# Altium schematic sheet MCU.SchDoc
size A; SheetNumber: 4; SheetTotal: 7
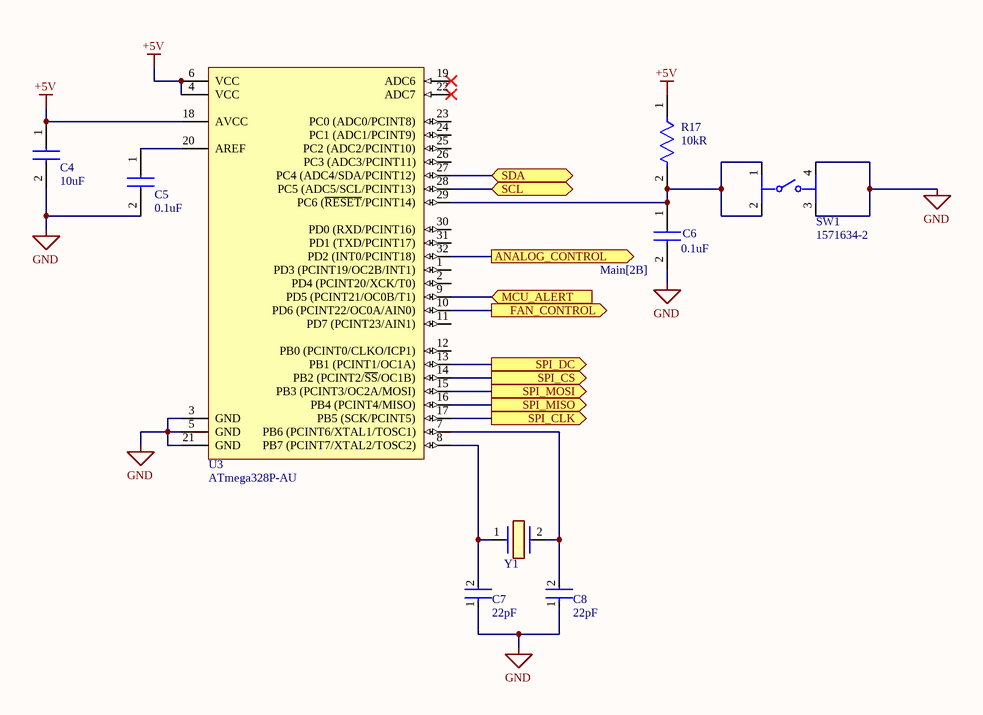
[diagram p0: MCU.SchDoc]

## Parts
C4  Capacitance: 10uF  [CAPC3216X180N]  (hidden comment: CL31A106MAHNNNE)
C5  Capacitance: 0.1uF  [CAPC3216X100N]  (hidden comment: CL31B104KBCNNNC)
C6  Capacitance: 0.1uF  [CAPC3216X100N]  (hidden comment: CL31B104KBCNNNC)
C7  Capacitance: 22pF  [FP-CL31-IPC_A]  (hidden comment: CL31C220JBCNNNC)
C8  Capacitance: 22pF  [FP-CL31-IPC_A]  (hidden comment: CL31C220JBCNNNC)
R17  Resistance: 10kR  [FP-RMCF1206-IPC_B]  (hidden comment: RMCF1206FT10K0)
SW1  1571634-2  [FP-1571634-2-MFG]
U3  ATmega328P-AU  [32A_M]
Y1  ECS-160-20-3X-TR  [ECS160203XTR]  (value not drawn)

## Ports
ANALOG_CONTROL (out, see Main[2B]), FAN_CONTROL (out, see Main[1B]), MCU_ALERT (in, see Main[2C], Sense Amplifier[4C]), SCL (bidir, see Main[2C], DAC[2B], Sense Amplifier[3B]), SDA (bidir, see Main[2C], DAC[2B], Sense Amplifier[3B]), SPI_CLK (out, see Main[1C]), SPI_CS (out, see Main[1C]), SPI_DC (out, see Main[1C]), SPI_MISO (out, see Main[1C]), SPI_MOSI (out, see Main[1C])

## Nets
+5V: C4.1 R17.1 U3.4(VCC) U3.6(VCC) U3.18(AVCC)
GND: C4.2 C5.2 C6.2 C7.1 C8.1 SW1.3 SW1.4 U3.3(GND) U3.5(GND) U3.21(GND)
ANALOG_CONTROL: U3.32(PD2_(INT0/PCINT18)) ; port ANALOG_CONTROL
FAN_CONTROL: U3.10(PD6_(PCINT22/OC0A/AIN0)) ; port FAN_CONTROL
MCU_ALERT: U3.9(PD5_(PCINT21/OC0B/T1)) ; port MCU_ALERT
SCL: U3.28(PC5_(ADC5/SCL/PCINT13)) ; port SCL
SDA: U3.27(PC4_(ADC4/SDA/PCINT12)) ; port SDA
SPI_CLK: U3.17(PB5_(SCK/PCINT5)) ; port SPI_CLK
SPI_CS: U3.14(PB2_(PCINT2/~{SS}/OC1B)) ; port SPI_CS
SPI_DC: U3.13(PB1_(PCINT1/OC1A)) ; port SPI_DC
SPI_MISO: U3.16(PB4_(PCINT4/MISO)) ; port SPI_MISO
SPI_MOSI: U3.15(PB3_(PCINT3/OC2A/MOSI)) ; port SPI_MOSI
NetC5_1: C5.1 U3.20(AREF)
NetC6_1: C6.1 R17.2 SW1.1 SW1.2 U3.29(PC6_(~{RESET}/PCINT14))
NetC7_2: C7.2 U3.8(PB7_(PCINT7/XTAL2/TOSC2)) Y1.1(X1)
NetC8_2: C8.2 U3.7(PB6_(PCINT6/XTAL1/TOSC1)) Y1.2(X2)

Not connected (* = marked no-connect by the designer): U3 1(PD3_(PCINT19/OC2B/INT1)) 2(PD4_(PCINT20/XCK/T0)) 11(PD7_(PCINT23/AIN1)) 12(PB0_(PCINT0/CLKO/ICP1)) 19(ADC6)* 22(ADC7)* 23(PC0_(ADC0/PCINT8)) 24(PC1_(ADC1/PCINT9)) 25(PC2_(ADC2/PCINT10)) 26(PC3_(ADC3/PCINT11)) 30(PD0_(RXD/PCINT16)) 31(PD1_(TXD/PCINT17))

## Library data of the parts
C4 = CL31A106MAHNNNE: CAP CER 10UF 25V X5R 1206 CL31A106MAHNNNE; Manufacturer_Name: SAMSUNG; Datasheet Link: https://www.arrow.com/en/products/cl31a106mahnnne/samsung-electro-mechanics; Height: 1.8mm; Manufacturer_Part_Number: CL31A106MAHNNNE; Mouser Part Number: 187-CL31A106MAHNNNE; Mouser Price/Stock: https://www.mouser.co.uk/ProductDetail/Samsung-Electro-Mechanics/CL31A106MAHNNNE?qs=9y2YoPkPyvYkOWbcUKSn%252BQ%3D%3D; Arrow Part Number: CL31A106MAHNNNE; Arrow Price/Stock: https://www.arrow.com/en/products/cl31a106mahnnne/samsung-electro-mechanics; Supplier 1: Digi-Key; Supplier Part Number 1: 1276-1181-1-ND
C5 C6 = CL31B104KBCNNNC: CAP CER 0.1UF 50V X7R 1206; Manufacturer_Name: SAMSUNG; Datasheet Link: https://datasheet.datasheetarchive.com/originals/distributors/Datasheets_SAMA/0fdb6a11e020a7299f4d0713dd2bd7ee.pdf; Height: 1mm; Mouser Part Number: 187-CL31B104KBCNNNC; Mouser Price/Stock: https://www.mouser.co.uk/ProductDetail/Samsung-Electro-Mechanics/CL31B104KBCNNNC?qs=349EhDEZ59oHABbyGq1iKA%3D%3D; Arrow Part Number: CL31B104KBCNNNC; Arrow Price/Stock: https://www.arrow.com/en/products/cl31b104kbcnnnc/samsung-electro-mechanics?region=nac; Supplier 1: Digi-Key; Supplier Part Number 1: 1276-1017-1-ND
  C5: Manufacturer_Part_Number 1: CL31B104KBCNNNC
  C6: Manufacturer_Part_Number: CL31B104KBCNNNC
C7 C8 = CMP-13271-001055-1: Cap Ceramic 22pF 50V C0G ±5% SMD 1206 +125°C Embossed T/R; Temperature Coefficient: 300ppm/°C; Packaging: Tape and Reel; Material: Ceramic; Package Quantity: 1; Thickness: 0.039inch; Voltage: 50V; Height: 0.85mm; Radiation Hardening: No; Mount: Surface Mount; Width: 0.063inch; Min Operating Temperature: -55°C; Max Operating Temperature: 125°C; Voltage Rating (DC): 50V; Voltage Rating: 50V; Case/Package: 1206; Case Code (Metric): 3216; Tolerance: 5%; Length: 3.2mm; Dielectric: C0G; Lead Free: Lead Free; Depth: 1.6mm; Case Code (Imperial): 1206
R17 = CMP-26527-000151-1: 10kΩ ±1% 0.25W 1206 Thick Film Chip Resistor AEC-Q200 compliant RMCF1206FT10K0; Temperature Coefficient: 100ppm/°C; Max Power Dissipation: 250mW; Packaging: Tape and Reel; Resistor Type: Thick Film; Number of Terminations: 2; Depth: 1.6mm; Military Standard: Not; Contact Plating: Tin; Radiation Hardening: No; Lead Free: Lead Free; Tolerance: 1%; Length: 3.2mm; Size Code: 1206; RoHS Compliant: Yes; Case/Package: 1206; Mount: Surface Mount; Features: Automotive AEC-Q200; Min Operating Temperature: -55°C; Series: RMCF; Case Code (Imperial): 1206; Construction: Rectangular; Max Operating Temperature: 155°C; Width: 0.063inch; Height: 0.028inch; Power Rating: 250mW; Case Code (Metric): 3216
SW1 = CMP-03407-000008-1: SWITCH TACTILE SPST-NO 0.05A 24V; Actuator Length: 0.094inch; Max Current Rating: 50mA; Voltage Rating (DC): 12V; Actuator Material: Rubber; Switch Function: Off-Mom; Mechanical Life: 5000000Cycles; Actuator Type: Standard; Actuator Color: Natural; Illumination Type: Illuminated; Operating Force: 160gf; Throw Configuration: SPST; Package Quantity: 1000; Max Operating Temperature: 85°C; Mount: Surface Mount; Contact Plating: Silver; Depth: 10mm; Min Operating Temperature: -40°C; Radiation Hardening: No; ELV: Compliant; Case/Package: SMD/SMT; Length: 6.2mm; Termination: Gull Wing; Type: Switch; RoHS Compliant: Yes; Current Rating: 50mA; Contact Current Rating: 50mA; Orientation: Straight; Packaging: Tape and Reel; Max Voltage Rating (DC): 12V; Lead Free: Lead Free; Contact Material: Stainless Steel
U3 = CMP-0095-00269-2: 8-bit AVR Microcontroller, 32KB Flash, 1KB EEPROM, 2KB SRAM, 32-pin TQFP, Industrial Grade (-40°C to 85°C); PackageDescription: 32-Lead, 7x7x1.0 mm Body, 0.8mm Lead Pitch, Thin Profile Plastic Quad Flat Package (TQFP); DatasheetVersion: revD, May-2011; RevisionNote: DatasheetVersion & PackageVersion updated. URLs added.; ComponentLink1URL: http://www.atmel.com/; ComponentLink2Description: ATmega48A/48PA/88A/88PA/168A/168PA/328/328P Datasheet; Code_JEDEC: MS-026-ABA; ComponentLink1Description: Manufacturer URL; PackageReference: 32A; ComponentLink3Description: ATmega48A/48PA/88A/88PA/168A/168PA/328/328P Summary; ComponentLink2URL: http://www.atmel.com/dyn/resources/prod_documents/doc8271.pdf; PackageVersion: revC, Oct-2010; ComponentLink3URL: http://www.atmel.com/dyn/resources/prod_documents/8271S.pdf
Y1 = ECS-160-20-3X-TR: Crystal or Oscillator; Manufacturer_Name: ECS; Datasheet Link: https://www.arrow.com/en/products/ecs-160-20-3x-tr/ecs-international; Height: 2.3mm; Manufacturer_Part_Number: ECS-160-20-3X-TR; Mouser Part Number: 520-160-20-3XT; Mouser Price/Stock: https://www.mouser.co.uk/ProductDetail/ECS/ECS-160-20-3X-TR?qs=7Z%2FjUg96RbU1ElbRFXn8Rw%3D%3D; Arrow Part Number: ECS-160-20-3X-TR; Arrow Price/Stock: https://www.arrow.com/en/products/ecs-160-20-3x-tr/ecs-international?region=nac; Supplier 1: Digi-Key; Supplier Part Number 1: XC1776CT-ND